# EAGLE schematic climbing_WS2812 (EAGLE 6.3)
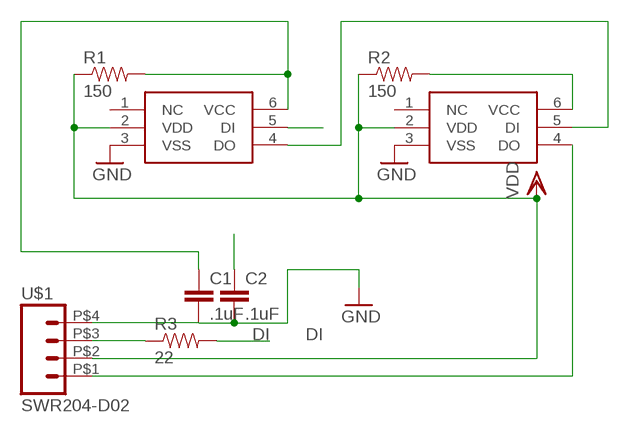
[diagram p0: schematic, sheet 1]

## Parts
C1  .1uF  CAP0402-CAP  [0402-CAP]
C2  .1uF  CAP0402-CAP  [0402-CAP]
R1  150  RESISTOR0402-RES  [0402-RES]
R2  150  RESISTOR0402-RES  [0402-RES]
R3  22  RESISTOR0402-RES  [0402-RES]
U$1  SWR204-D02  [SWR204]
U$2  WS2812  [RGBLED5050]
U$3  WS2812  [RGBLED5050]

## Nets
DI: R3.2 U$2.5(DI)
DODI: U$2.4(DO) U$3.5(DI)
GND: C1.2 C2.2 U$1.P$4 U$2.3(VSS) U$3.3(VSS)
N$1: R3.1 U$1.P$3
N$2: U$1.P$1 U$3.4(DO)
VCC: C1.1 R1.2 U$2.6(VCC)
VCC2: C2.1 R2.2 U$3.6(VCC)
VDD: R1.1 R2.1 U$1.P$2 U$2.2(VDD) U$3.2(VDD)
Unconnected: U$2.1(NC) U$3.1(NC)

## Library data of the parts
C1 C2 = SparkFun-Passives:CAP: Capacitor Standard 0603 ceramic capacitor, and 0.1" leaded capacitor.
R1-R3 = SparkFun-Passives:RESISTOR: Resistor Basic schematic elements and footprints for 0603, 1206, and PTH resistors.
U$1 = SparkFun-Connectors:SWR204-D02
U$2 U$3 = adafruit:WS2812